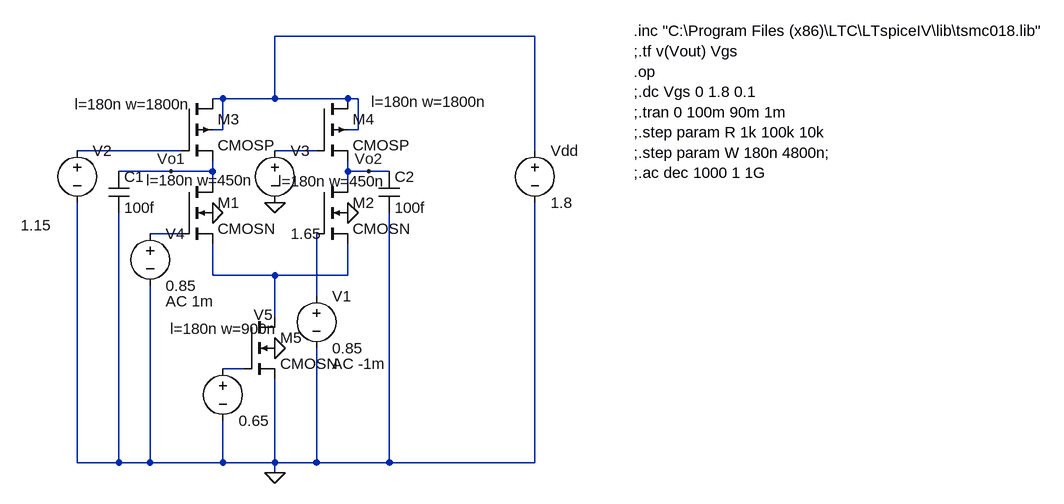
[diagram p0: schematic differential3.asc]
differential3.asc, the LTspice schematic file:
Version 4
SHEET 1 1608 728
WIRE 736 -96 336 -96
WIRE 256 0 240 0
WIRE 336 0 336 -96
WIRE 336 0 256 0
WIRE 448 0 336 0
WIRE 464 0 448 0
WIRE 256 48 256 0
WIRE 256 48 240 48
WIRE 464 48 464 0
WIRE 464 48 448 48
WIRE 192 80 32 80
WIRE 400 80 336 80
WIRE 736 80 736 -96
WIRE 176 112 96 112
WIRE 240 112 240 96
WIRE 240 112 176 112
WIRE 448 112 448 96
WIRE 480 112 448 112
WIRE 512 112 480 112
WIRE 240 128 240 112
WIRE 448 128 448 112
WIRE 192 208 144 208
WIRE 240 272 240 224
WIRE 336 272 240 272
WIRE 448 272 448 224
WIRE 448 272 336 272
WIRE 400 304 400 208
WIRE 336 336 336 272
WIRE 288 416 256 416
WIRE 32 560 32 160
WIRE 96 560 96 176
WIRE 96 560 32 560
WIRE 144 560 144 288
WIRE 144 560 96 560
WIRE 256 560 256 496
WIRE 256 560 144 560
WIRE 336 560 336 432
WIRE 336 560 256 560
WIRE 400 560 400 384
WIRE 400 560 336 560
WIRE 512 560 512 176
WIRE 512 560 400 560
WIRE 736 560 736 160
WIRE 736 560 512 560
WIRE 336 576 336 560
FLAG 336 576 0
FLAG 176 112 Vo1
FLAG 480 112 Vo2
FLAG 240 176 0
FLAG 448 176 0
FLAG 336 160 0
FLAG 336 384 0
SYMBOL cmosn 192 128 R0
WINDOW 123 -54 -2 Left 2
SYMATTR Value2 l=180n w=450n
SYMATTR InstName M1
SYMBOL cmosn 400 128 R0
WINDOW 123 -59 -1 Left 2
SYMATTR Value2 l=180n w=450n
SYMATTR InstName M2
SYMBOL cmosp 192 0 R0
WINDOW 123 -164 9 Left 2
SYMATTR Value2 l=180n w=1800n
SYMATTR InstName M3
SYMBOL cmosp 400 0 R0
WINDOW 123 84 5 Left 2
SYMATTR Value2 l=180n w=1800n
SYMATTR InstName M4
SYMBOL voltage 736 64 R0
WINDOW 123 0 0 Left 2
WINDOW 39 0 0 Left 2
SYMATTR InstName Vdd
SYMATTR Value 1.8
SYMBOL voltage 32 64 R0
WINDOW 3 -87 131 Left 2
WINDOW 123 24 40 Left 2
WINDOW 39 0 0 Left 2
SYMATTR Value 1.15
SYMATTR InstName V2
SYMBOL voltage 336 64 R0
WINDOW 3 24 144 Left 2
WINDOW 123 24 120 Left 2
WINDOW 39 0 0 Left 2
SYMATTR Value 1.65
SYMATTR InstName V3
SYMBOL voltage 144 192 R0
WINDOW 123 24 120 Left 2
WINDOW 39 0 0 Left 2
SYMATTR Value2 AC 1m
SYMATTR InstName V4
SYMATTR Value 0.85
SYMBOL cap 80 112 R0
SYMATTR InstName C1
SYMATTR Value 100f
SYMBOL cap 496 112 R0
SYMATTR InstName C2
SYMATTR Value 100f
SYMBOL cmosn 288 336 R0
WINDOW 123 -113 18 Left 2
SYMATTR InstName M5
SYMATTR Value2 l=180n w=900n
SYMBOL voltage 256 400 R0
WINDOW 0 47 -67 Left 2
WINDOW 123 0 0 Left 2
WINDOW 39 0 0 Left 2
SYMATTR InstName V5
SYMATTR Value 0.65
SYMBOL voltage 400 288 R0
WINDOW 123 24 120 Left 2
WINDOW 39 0 0 Left 2
SYMATTR InstName V1
SYMATTR Value 0.85
SYMATTR Value2 AC -1m
TEXT 888 -104 Left 2 !.inc "C:\\Program Files (x86)\\LTC\\LTspiceIV\\lib\\tsmc018.lib"\n;.tf v(Vout) Vgs\n.op\n;.dc Vgs 0 1.8 0.1\n;.tran 0 100m 90m 1m\n;.step param R 1k 100k 10k\n;.step param W 180n 4800n;\n;.ac dec 1000 1 1G

The netlist it stands for:
* differential3.asc
M1 Vo1 N004 N005 0 CMOSN l=180n w=450n
M2 Vo2 N006 N005 0 CMOSN l=180n w=450n
M3 N001 N002 Vo1 N001 CMOSP l=180n w=1800n
M4 N001 N003 Vo2 N001 CMOSP l=180n w=1800n
Vdd N001 0 1.8
V2 N002 0 1.15
V3 N003 0 1.65
V4 N004 0 0.85 AC 1m
C1 Vo1 0 100f
C2 Vo2 0 100f
M5 N005 N007 0 0 CMOSN l=180n w=900n
V5 N007 0 0.65
V1 N006 0 0.85 AC -1m
.model NMOS NMOS
.model PMOS PMOS
.lib standard.mos
.inc "C:\Program Files (x86)\LTC\LTspiceIV\lib\tsmc018.lib"
;.tf v(Vout) Vgs
.op
;.dc Vgs 0 1.8 0.1
;.tran 0 100m 90m 1m
;.step param R 1k 100k 10k
;.step param W 180n 4800n;
;.ac dec 1000 1 1G
.backanno
.end